# Altium schematic sheet USBHost.SchDoc
size A; PageSetup: Record=PageOptions|CenterHorizontal=True|CenterVertical=True|PrintScale=1.07|XCorrection=1.00|YCorrection=1.00|PrintKind=1|BorderSize=5000000|LeftOffset=0|BottomOffset=0|Orientation=2|PaperLength=1000|PaperWidth=1000|Scale=100|PaperSource=257|PrintQuality=600|MediaType=1|DitherType=10|PrintScaleMode=1|PaperKind=Letter|PaperIndex=1
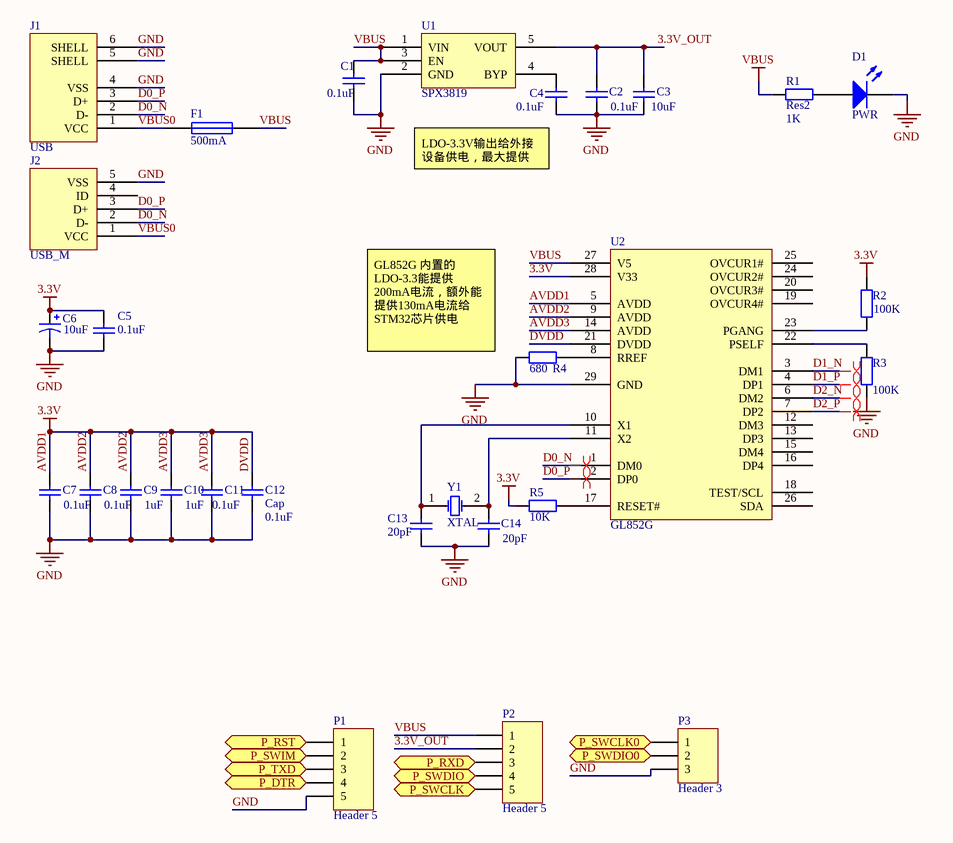
[diagram p0: USBHost.SchDoc]

## Parts
C1  value 0.1uF  [C-0603]  (hidden comment: Cap)
C2  value 0.1uF  [C-0603]  (hidden comment: Cap)
C3  value 10uF  [C-0603]  (hidden comment: Cap)
C4  value 0.1uF  [C-0603]  (hidden comment: Cap)
C5  value 0.1uF  [C-0603]  (hidden comment: Cap)
C6  value 10uF  [C-0603]  (hidden comment: Cap Pol1)
C7  value 0.1uF  [C-0603]  (hidden comment: Cap)
C8  value 0.1uF  [C-0603]  (hidden comment: Cap)
C9  value 1uF  [C-0603]  (hidden comment: Cap)
C10  value 1uF  [C-0603]  (hidden comment: Cap)
C11  value 0.1uF  [C-0603]  (hidden comment: Cap)
C12  Cap  value 0.1uF  [C-0603]
C13  value 20pF  [C-0603]  (hidden comment: Cap)
C14  value 20pF  [C-0603]  (hidden comment: Cap)
D1  PWR  [SMT_LED_0603]
F1  value 500mA  [0805-1]  (hidden comment: Fuse1)
J1  USB  [USB-B]
J2  USB_M  [USB_MICRO_5S_B]
P1  Header 5  [HEADER 5]
P2  Header 5  [HEADER 5]
P3  Header 3  [SIP3-1.27]
R1  Res2  value 1K  [0603-1]
R2  value 100K  [0603-1]  (hidden comment: Res2)
R3  value 100K  [0603-1]  (hidden comment: Res2)
R4  value 680  [0603-1]  (hidden comment: Res1)
R5  value 10K  [0603-1]  (hidden comment: Res2)
U1  SPX3819  [SOT23-5]
U2  GL852G  [QFN28-L]
Y1  XTAL  [XAL5032 2-Leads]

## Ports
P_DTR, P_RST, P_RXD, P_SWCLK, P_SWCLK0, P_SWDIO, P_SWDIO0, P_SWIM, P_TXD

## Nets
3.3V: C5.1 C6.1 C7.2 C8.2 C9.2 C10.2 C11.2 C12.2 R2.2 R5.2 U2.5(AVDD) U2.9(AVDD) U2.14(AVDD) U2.21(DVDD) U2.28(V33)  [also labelled AVDD1, AVDD2, AVDD3, DVDD]
GND: C1.1 C2.1 C3.1 C4.1 C5.2 C6.2 C7.1 C8.1 C9.1 C10.1 C11.1 C12.1 C13.1 C14.1 D1.2(K) J1.4(VSS) J1.5(SHELL) J1.6(SHELL) J2.5(VSS) P1.5 P3.3 R3.1 R4.1 U1.2(GND) U2.29(GND)
VBUS: C1.2 F1.1 P2.1 R1.1 U1.1(VIN) U1.3(EN) U2.27(V5)
3.3V_OUT: C2.2 C3.2 P2.2 U1.5(VOUT)
D0_N: J1.2(D-) J2.2(D-) U2.1(DM0)
D0_P: J1.3(D+) J2.3(D+) U2.2(DP0)
D1_N: U2.3(DM1)
D1_P: U2.4(DP1)
D2_N: U2.6(DM2)
D2_P: U2.7(DP2)
P_DTR: P1.4 ; port P_DTR
P_RST: P1.1 ; port P_RST
P_RXD: P2.3 ; port P_RXD
P_SWCLK: P2.5 ; port P_SWCLK
P_SWCLK0: P3.1 ; port P_SWCLK0
P_SWDIO: P2.4 ; port P_SWDIO
P_SWDIO0: P3.2 ; port P_SWDIO0
P_SWIM: P1.2 ; port P_SWIM
P_TXD: P1.3 ; port P_TXD
VBUS0: F1.2 J1.1(VCC) J2.1(VCC)
NetC4_2: C4.2 U1.4(BYP)
NetC13_2: C13.2 U2.10(X1) Y1.1(OSC1)
NetC14_2: C14.2 U2.11(X2) Y1.2(OSC2)
NetD1_1: D1.1(A) R1.2
NetR2_1: R2.1 U2.23(PGANG)
NetR3_2: R3.2 U2.22(PSELF)
NetR4_2: R4.2 U2.8(RREF)
NetR5_1: R5.1 U2.17(RESET#)

Not connected (* = marked no-connect by the designer): J2 4(ID); U2 12(DM3) 13(DP3) 15(DM4) 16(DP4) 18(TEST/SCL) 19(OVCUR4#) 20(OVCUR3#) 24(OVCUR2#) 25(OVCUR1#) 26(SDA)

## Layout directives
differential pair: D0_N, D0_P, D1_N, D1_P, D2_N, D2_P

## Notes on the sheet
- (near C4) LDO-3.3V输出给外接设备供电，最大提供500mA电流
- (near R4) GL852G 内置的LDO-3.3能提供200mA电流，额外能提供130mA电流给STM32芯片供电

## Library data of the parts
C1-C5 C7-C14 = Cap: Capacitor; Published: 8-Jun-2000; LatestRevisionDate: 17-Jul-2002; LatestRevisionNote: Re-released for DXP Platform.; PackageReference: RAD-0.3; Publisher: Altium Limited; PackageDescription: Radial Cap, Thru-Hole; 2 Leads; 0.3 in Pin Spacing
C6 = Cap Pol1: Polarized Capacitor (Radial); Published: 8-Jun-2000; LatestRevisionDate: 17-Jul-2002; LatestRevisionNote: Re-released for DXP Platform.; PackageReference: RB7.6-15; Publisher: Altium Limited; PackageDescription: Polarized Capacitor (Radial); 2 Leads
D1 = LED2: Typical RED, GREEN, YELLOW, AMBER GaAs LED; Published: 8-Jun-2000; LatestRevisionDate: 17-Jul-2002; LatestRevisionNote: Re-released for DXP Platform.; PackageVersion: Feb-2002; PackageReference: 3.2X1.6X1.1; Publisher: Altium Limited; PackageDescription: SM LED; 2 Flat Leads
F1 = Fuse1: 保险丝
J1 = USB: USB接口
J2 = USB_M: Micro/Mini USB
P1 P2 = Header 5: Header, 5-Pin; LatestRevisionDate: 17-Jul-2002; LatestRevisionNote: Re-released for DXP Platform.; Publisher: Altium Limited
P3 = Header 3: Header, 3-Pin; LatestRevisionDate: 17-Jul-2002; LatestRevisionNote: Re-released for DXP Platform.; Publisher: Altium Limited
R1-R3 R5 = Res2: Resistor; Published: 8-Jun-2000; LatestRevisionDate: 17-Jul-2002; LatestRevisionNote: Re-released for DXP Platform.; PackageReference: AXIAL-0.4; Publisher: Altium Limited; PackageDescription: Axial Device, Thru-Hole; 2 Leads; 0.4 in Pin Spacing
R4 = Res1: 贴片电阻; Published: 8-Jun-2000; LatestRevisionDate: 17-Jul-2002; LatestRevisionNote: Re-released for DXP Platform.; PackageReference: AXIAL-0.4; Publisher: Altium Limited
Y1 = XTAL: Crystal Oscillator; Published: 8-Jun-2000; LatestRevisionDate: 17-Jul-2002; LatestRevisionNote: Re-released for DXP Platform.; PackageReference: R38; Publisher: Altium Limited; PackageDescription: Crystal, Thru-Hole; 2 Leads; Body 3.1 x 8.2 mm (Dia.xH)